# EAGLE board GNUBLIN_LAN_V2.3 (EAGLE 6.4), part 1 of 2
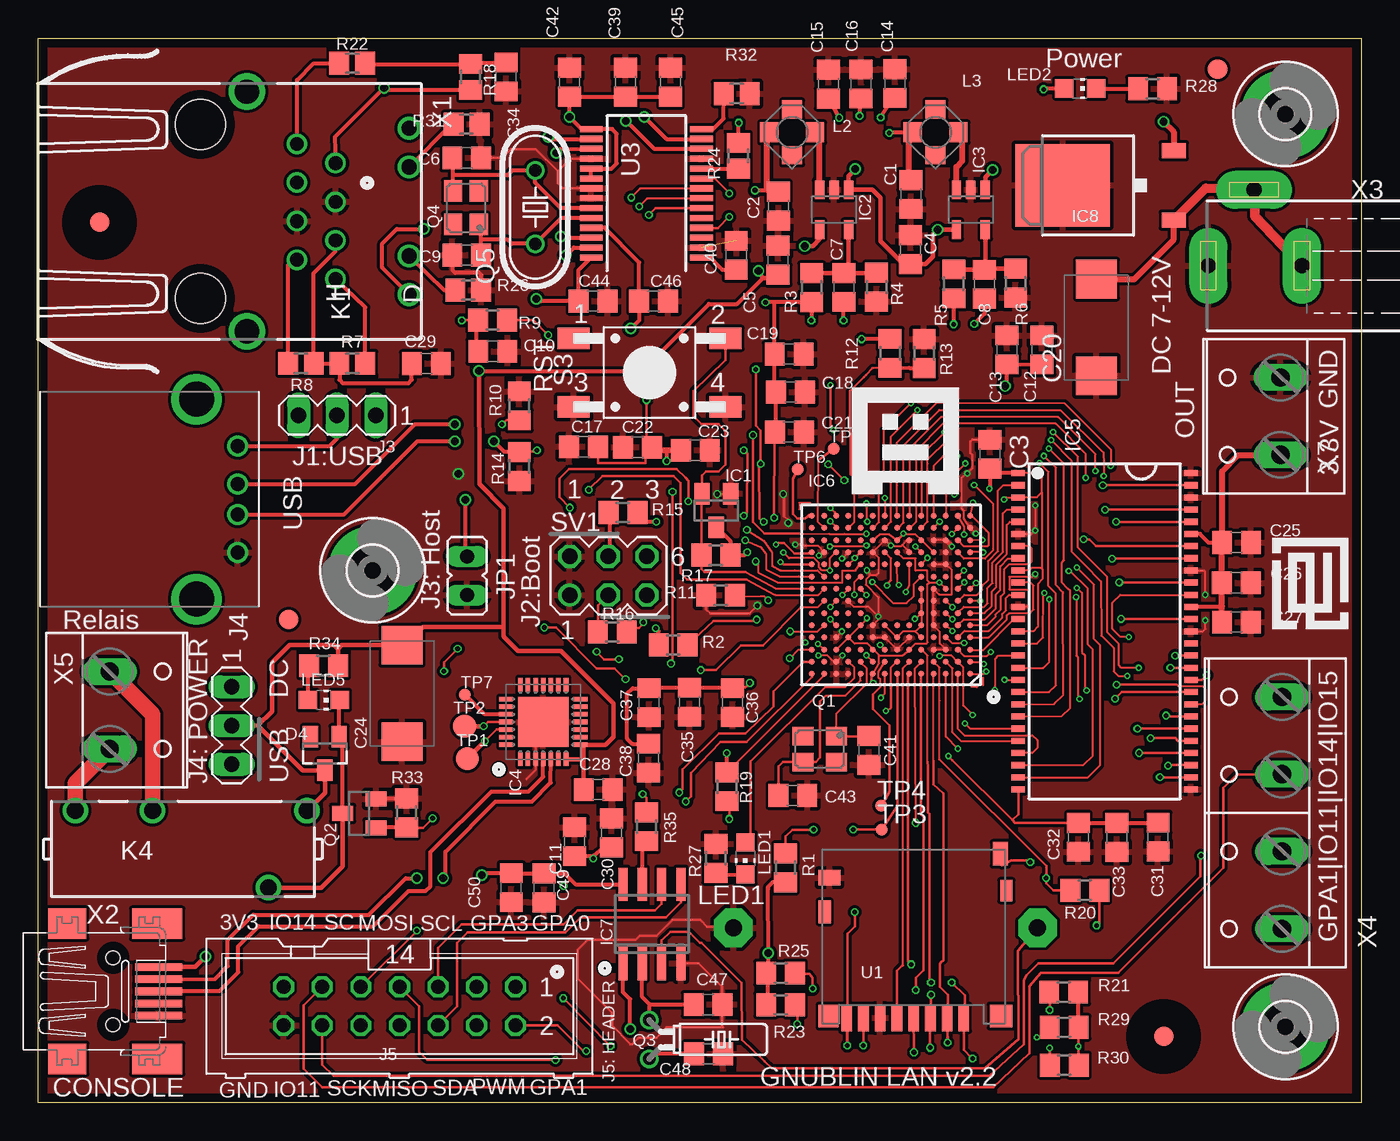
[diagram p4: board, top side]
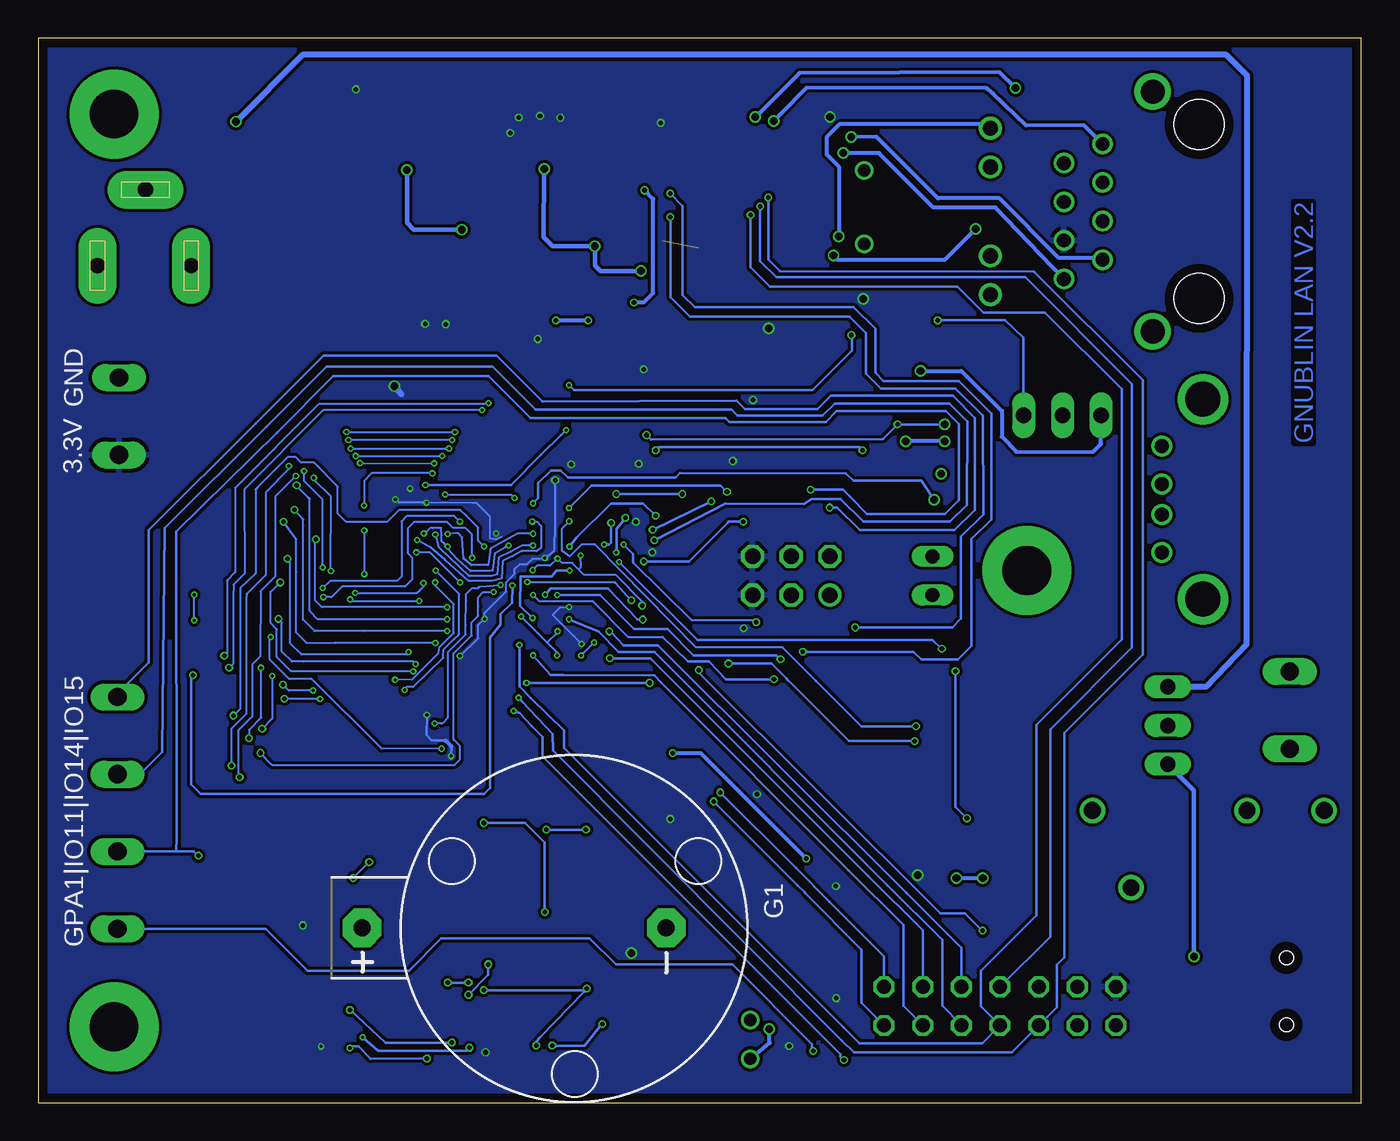
[diagram p5: board, bottom side, seen from below]

Size 87 x 70 mm. Coordinates in mm from the lower left corner, seen from the top.
Outline: 0,70 87,70 87,0 0,0 0,70
Copper layers (1*16): Top 0.035mm / dielectric 0.1mm / Bottom 0.035mm
Design rules "default *": minimum track width 0.12mm, minimum drill 0.2mm, track to track 0.12mm, track to pad 0.12mm, pad to pad 0.12mm, via to via 0.12mm, smd to smd 0mil, copper to edge 0.6mm, drill to drill 8mil, minimum pad ring 6mil, minimum via ring 4mil, stop-mask expansion 2mil, vias tented up to drill 40mil, thermal gap 10mil
Net classes: 0 default: width 0.2 mm, drill 0.3 mm, clearance 0.2 mm; 1 500mA: width 0.3 mm, drill 0.3 mm, clearance 0.15 mm

## Footprints (pad centres in the part's own frame; a part is rotated, then mirrored left to right if it is on the bottom)
C0805 = smd 1.3 x 1.5: 1 -0.95,0; 2 0.95,0
D/7343-31R = smd 2.55 x 2.7: + 3.175,0; - -3.175,0
DIODE_SOT23 = smd 1 x 1.4: 1 -0.95,-1.1; 2 0.95,-1.1; 3 0,1.1
PASSERMARKEN_FIDUCIAL = smd 1.27 x 1.27: 1 0,0
CH25 = drill 1.118 pad 2.54 octagon: + 0,-14; - 0,6
3,2-PAD = drill 3.2 pad 5.842: B3,2 0,0
SOT23 = smd 1 x 1.4: 1 -0.95,-1.1; 2 0.95,-1.1; 3 0,1.1
TSOT23 = smd 0.622 x 1.22: 1 -0.95,-1.31; 2 0,-1.31; 3 0.95,-1.31; 4 0.95,1.31; 5 -0.95,1.31
MLP28 = smd 0.9 x 0.3: 1 -2.45,1.5; 2 -2.45,1; 3 -2.45,0.5; 4 -2.45,0; 5 -2.45,-0.5; 6 -2.45,-1; 7 -2.45,-1.5; 15 2.45,-1.5; 16 2.45,-1; 17 2.45,-0.5; 18 2.45,0; 19 2.45,0.5; 20 2.45,1; 21 2.45,1.5 | smd 0.3 x 0.9: 8 -1.5,-2.45; 9 -1,-2.45; 10 -0.5,-2.45; 11 0,-2.45; 12 0.5,-2.45; 13 1,-2.45; 14 1.5,-2.45; 22 1.5,2.45; 23 1,2.45; 24 0.5,2.45; 25 0,2.45; 26 -0.5,2.45; 27 -1,2.45; 28 -1.5,2.45 | smd 3.3 x 3.3: EXP 0,0
TSOPII = smd 0.4 x 0.9: 1 1.03,0.67; 2 1.83,0.67; 3 2.63,0.67; 4 3.43,0.67; 5 4.23,0.67; 6 5.03,0.67; 7 5.83,0.67; 8 6.63,0.67; 9 7.43,0.67; 10 8.23,0.67; 11 9.03,0.67; 12 9.83,0.67; 13 10.63,0.67; 14 11.43,0.67; 15 12.23,0.67; 16 13.03,0.67; 17 13.83,0.67; 18 14.63,0.67; 19 15.43,0.67; 20 16.23,0.67; 21 17.03,0.67; 22 17.83,0.67; 23 18.63,0.67; 24 19.43,0.67; 25 20.23,0.67; 26 21.03,0.67; 27 21.83,0.67; 28 21.83,12.03; 29 21.03,12.03; 30 20.23,12.03; 31 19.43,12.03; 32 18.63,12.03; 33 17.83,12.03; 34 17.03,12.03; 35 16.23,12.03; 36 15.43,12.03; 37 14.63,12.03; 38 13.83,12.03; 39 13.03,12.03; 40 12.23,12.03; 41 11.43,12.03; 42 10.63,12.03; 43 9.83,12.03; 44 9.03,12.03; 45 8.23,12.03; 46 7.43,12.03; 47 6.63,12.03; 48 5.83,12.03; 49 5.03,12.03; 50 4.23,12.03; 51 3.43,12.03; 52 2.63,12.03; 53 1.83,12.03; 54 1.03,12.03
TFBGA180 = smd 0.4 x 0.4: A1 -5.2,5.2; A2 -4.4,5.2; A3 -3.6,5.2; A4 -2.8,5.2; A5 -2,5.2; A6 -1.2,5.2; A7 -0.4,5.2; A8 0.4,5.2; A9 1.2,5.2; A10 2,5.2; A11 2.8,5.2; A12 3.6,5.2; A13 4.4,5.2; A14 5.2,5.2; B1 -5.2,4.4; B2 -4.4,4.4; B3 -3.6,4.4; B4 -2.8,4.4; B5 -2,4.4; B6 -1.2,4.4; B7 -0.4,4.4; B8 0.4,4.4; B9 1.2,4.4; B10 2,4.4; B11 2.8,4.4; B12 3.6,4.4; B13 4.4,4.4; B14 5.2,4.4; C1 -5.2,3.6; C2 -4.4,3.6; C3 -3.6,3.6; C4 -2.8,3.6; C5 -2,3.6; C6 -1.2,3.6; C7 -0.4,3.6; C8 0.4,3.6; C9 1.2,3.6; C10 2,3.6; C11 2.8,3.6; C12 3.6,3.6; C13 4.4,3.6; C14 5.2,3.6; D1 -5.2,2.8; D2 -4.4,2.8; D3 -3.6,2.8; D4 -2.8,2.8; D5 -2,2.8; D6 -1.2,2.8; D7 -0.4,2.8; D8 0.4,2.8; D9 1.2,2.8; D10 2,2.8; D11 2.8,2.8; D12 3.6,2.8; D13 4.4,2.8; D14 5.2,2.8; E1 -5.2,2; E2 -4.4,2; E3 -3.6,2; E4 -2.8,2; E5 -2,2; E6 -1.2,2; E7 -0.4,2; E8 0.4,2; E9 1.2,2; E10 2,2; E11 2.8,2; E12 3.6,2; E13 4.4,2; E14 5.2,2; F1 -5.2,1.2; F2 -4.4,1.2; F3 -3.6,1.2; F4 -2.8,1.2; F5 -2,1.2; F10 2,1.2; F11 2.8,1.2; F12 3.6,1.2; F13 4.4,1.2; F14 5.2,1.2; G1 -5.2,0.4; G2 -4.4,0.4; G3 -3.6,0.4; G4 -2.8,0.4; G5 -2,0.4; G10 2,0.4; G11 2.8,0.4; G12 3.6,0.4; G13 4.4,0.4; G14 5.2,0.4; H1 -5.2,-0.4; H2 -4.4,-0.4; H3 -3.6,-0.4; H4 -2.8,-0.4; H5 -2,-0.4; H10 2,-0.4; H11 2.8,-0.4; H12 3.6,-0.4; H13 4.4,-0.4; H14 5.2,-0.4; J1 -5.2,-1.2; J2 -4.4,-1.2; J3 -3.6,-1.2; J4 -2.8,-1.2; J5 -2,-1.2; J10 2,-1.2; J11 2.8,-1.2; J12 3.6,-1.2; J13 4.4,-1.2; J14 5.2,-1.2; K1 -5.2,-2; K2 -4.4,-2; K3 -3.6,-2; K4 -2.8,-2; K5 -2,-2; K6 -1.2,-2; K7 -0.4,-2; K8 0.4,-2; K9 1.2,-2; K10 2,-2; K11 2.8,-2; K12 3.6,-2; K13 4.4,-2; K14 5.2,-2; L1 -5.2,-2.8; L2 -4.4,-2.8; L3 -3.6,-2.8; L4 -2.8,-2.8; L5 -2,-2.8; L6 -1.2,-2.8; L7 -0.4,-2.8; L8 0.4,-2.8; L9 1.2,-2.8; L10 2,-2.8; L11 2.8,-2.8; L12 3.6,-2.8; L13 4.4,-2.8; L14 5.2,-2.8; M1 -5.2,-3.6; M2 -4.4,-3.6; M3 -3.6,-3.6; M4 -2.8,-3.6; M5 -2,-3.6; M6 -1.2,-3.6; M7 -0.4,-3.6; M8 0.4,-3.6; M9 1.2,-3.6; M10 2,-3.6; M11 2.8,-3.6; M12 3.6,-3.6; M13 4.4,-3.6; M14 5.2,-3.6; N1 -5.2,-4.4; N2 -4.4,-4.4; N3 -3.6,-4.4; N4 -2.8,-4.4; N5 -2,-4.4; N6 -1.2,-4.4; N7 -0.4,-4.4; N8 0.4,-4.4; N9 1.2,-4.4; N10 2,-4.4; N11 2.8,-4.4; N12 3.6,-4.4; N13 4.4,-4.4; N14 5.2,-4.4; P1 -5.2,-5.2; P2 -4.4,-5.2; P3 -3.6,-5.2; P4 -2.8,-5.2; P5 -2,-5.2; P6 -1.2,-5.2; P7 -0.4,-5.2; P8 0.4,-5.2; P9 1.2,-5.2; P10 2,-5.2; P11 2.8,-5.2; P12 3.6,-5.2; P13 4.4,-5.2; P14 5.2,-5.2
SOIC-8 = smd 0.6 x 2.2: 1 -1.905,-2.6; 2 -0.635,-2.6; 3 0.635,-2.6; 4 1.905,-2.6; 5 1.905,2.6; 6 0.635,2.6; 7 -0.635,2.6; 8 -1.905,2.6
DPACK_3 = smd 1 x 1.6: 1 -2.28,-4.8; 3 2.28,-4.8 | smd 5.4 x 6.2: 4 0,2.5
MA03-1 = drill 1.016 long: 1 -2.54,0; 2 0,0; 3 2.54,0
ML14 = drill 0.914 octagon: 1 -7.62,-1.27; 2 -7.62,1.27; 3 -5.08,-1.27; 4 -5.08,1.27; 5 -2.54,-1.27; 6 -2.54,1.27; 7 0,-1.27; 8 0,1.27; 9 2.54,-1.27; 10 2.54,1.27; 11 5.08,-1.27; 12 5.08,1.27; 13 7.62,-1.27; 14 7.62,1.27
JP1 = drill 0.914 long: 1 0,-1.27; 2 0,1.27
61400416021 = drill 0.92: 1 -3.5,2.7; 2 -1,2.7; 3 1,2.7; 4 3.5,2.7 | drill 2.3: 5 -6.57,0; 6 6.57,0
RELAY_G6D = drill 1.1 pad 1.676: 1 8.08,2.5; 5 -2.08,2.5; 7 -7.16,2.5; 13 5.54,-2.58
PSU3014 = smd 1.2 x 1.3: 1 -1.5,0; 2 1.5,0 | smd 1.3 x 1.2: 3 0,1.5; 4 0,-1.5
CHIP-LED0805 = smd 1.2 x 1.2: A 0,-1.05; C 0,1.05
SX-32 = smd 1.4 x 1.2: 1 -1.1,-0.85; 2 1.1,-0.85; 3 1.1,0.85; 4 -1.1,0.85
TRANSISTOR-SMALL-SIGNAL_SOT23 = smd 1 x 1.4: 1 -0.95,-1.1; 2 0.95,-1.1; 3 0,1.1
TC26H = drill 0.813: 1 -1.27,0; 2 1.27,0
HC49/S = drill 0.813: 1 -2.413,0; 2 2.413,0
R0805 = smd 1.3 x 1.5: 1 -0.95,0; 2 0.95,0
R0805' = smd 1.3 x 1.5: 1 -0.85,0; 2 0.85,0
TASTER-9314_SMD = smd 2.1 x 1.4: 1 -5,2.25; 2 5,2.25; 3 -5,-2.25; 4 5,-2.25
MA03-2 = drill 1.016: 1 -2.54,-1.27 | drill 1.016 octagon: 2 -2.54,1.27; 3 0,-1.27; 4 0,1.27; 5 2.54,-1.27; 6 2.54,1.27
TP15R = smd 1.5 x 1.5: TP 0,0
TP08R = smd 0.8 x 0.8: TP 0,0
DM3D-SF = smd 0.7 x 1.75: 1 7.7,-0.875; 2 6.6,-0.875; 3 5.5,-0.875; 4 4.4,-0.875; 5 3.3,-0.875; 6 2.2,-0.875; 7 1.1,-0.875; 8 0,-0.875 | smd 1.3 x 1.5: P$1 -1.2,-0.75 | smd 1.5 x 1.5: P$10 10.15,-0.75 | smd 0.8 x 1.4: P$11 10.5,7.5 | smd 0.8 x 1.5: P$13 -1.45,6.1 | smd 1 x 1.55: SW_A 10.1,9.925 | smd 1.45 x 1: SW_B -1.125,8.35
SSOP28 = smd 0.4 x 1.5: 1 -4.225,-3.625; 2 -3.575,-3.625; 3 -2.925,-3.625; 4 -2.275,-3.625; 5 -1.625,-3.625; 6 -0.975,-3.625; 7 -0.325,-3.625; 8 0.325,-3.625; 9 0.975,-3.625; 10 1.625,-3.625; 11 2.275,-3.625; 12 2.925,-3.625; 13 3.575,-3.625; 14 4.225,-3.625; 15 4.225,3.625; 16 3.575,3.625; 17 2.925,3.625; 18 2.275,3.625; 19 1.625,3.625; 20 0.975,3.625; 21 0.325,3.625; 22 -0.325,3.625; 23 -0.975,3.625; 24 -1.625,3.625; 25 -2.275,3.625; 26 -2.925,3.625; 27 -3.575,3.625; 28 -4.225,3.625
J1 = drill 0.9 pad 1.3: 1 4.445,2.54; 2 3.175,0; 3 1.905,2.54; 4 0.635,0; 5 -0.635,2.54; 6 -1.905,0; 7 -3.175,2.54; 8 -4.445,0 | drill 1 pad 1.422: 9 5.465,7.37; 10 2.925,7.37; 11 -2.925,7.37; 12 -5.465,7.37 | drill 1.6 pad 2.184: M1 -7.875,-3.3; M2 7.875,-3.3 | hole 3.3: 5.715,-6.35; -5.715,-6.35
32005-201 = smd 3.1 x 0.5: 1 3,1.6; 2 3,0.8; 3 3,0; 4 3,-0.8; 5 3,-1.6 | smd 2.5 x 2: M1 -3,-4.45; M2 -3,4.45 | smd 3.3 x 2: M3 2.9,4.45; M4 2.9,-4.45 | hole 0.9: 0,2.2; 0,-2.2
733980-62 = drill 1 pad 2.5 long: 1 0,8.57; 2 0,2.42; 3 5,5.57
W237-4P = drill 1.194 long: 1 -7.62,-0.635; 2 -2.54,-0.635; 3 2.54,-0.635; 4 7.62,-0.635
W237-132 = drill 1.194 long: 1 -2.54,-0.635; 2 2.54,-0.635

## Placement (x,y rotation side)
C1  10uF  [C0805]  57.37,59.71 90 top
C2  10uF  [C0805]  48.67,58.94 90 top
C3  100nF  [C0805]  62.58,42.64 270 top
C4  4.7uF  [C0805]  57.35,56.09 90 top
C5  4.7uF  [C0805]  48.65,55.39 90 top
C6  22pF  [C0805]  28.18,62.12 180 top
C7  22pF  [C0805]  52.98,53.6 90 top
C8  22pF  [C0805]  62.22,53.81 90 top
C9  22pF  [C0805]  28.18,55.73 0 top
C10  100nF  [C0805]  29.9,49.4 180 top
C11  100nF  [C0805]  35.27,17.17 270 top
C12  3.3nF  [C0805]  66,49.5 270 top
C13  10uF  [C0805]  63.7,49.5 270 top
C14  10uF  [C0805]  56.33,67.01 270 top
C15  3.3nF  [C0805]  51.95,66.97 270 top
C16  100nF  [C0805]  54.1,66.98 270 top
C17  3.3nF  [C0805]  35.86,43.13 0 top
C18  100nF  [C0805]  49.47,46.72 180 top
C19  3.3nF  [C0805]  49.38,49.23 180 top
C20  10uF  [D/7343-31R]  69.58,50.97 90 top
C21  10uF  [C0805]  49.39,44.1 180 top
C22  100nF  [C0805]  39.41,43.09 0 top
C23  10uF  [C0805]  43.21,42.9 180 top
C24  10uF  [D/7343-31R]  23.93,26.91 90 top
C25  3.3nF  [C0805]  78.79,36.83 180 top
C26  100nF  [C0805]  78.78,34.19 180 top
C27  10uF  [C0805]  78.78,31.6 180 top
C28  4.7uF  [C0805]  36.82,20.59 0 top
C29  100nF  [C0805]  25.53,48.6 0 top
C30  10uF  [C0805]  37.7,17.74 270 top
C31  3.3nF  [C0805]  73.63,17.47 90 top
C32  10uF  [C0805]  68.39,17.46 90 top
C33  100nF  [C0805]  70.92,17.44 90 top
C34  100nF  [C0805]  30.76,67.44 90 top
C35  100nF  [C0805]  42.82,26.33 90 top
C36  3.3nF  [C0805]  45.66,26.31 90 top
C37  10uF  [C0805]  40.17,26.3 90 top
C38  100nF  [C0805]  40.13,22.65 90 top
C39  100nF  [C0805]  38.61,67.1 90 top
C40  10uF  [C0805]  45.9,55.72 90 top
C41  22pF  [C0805]  54.62,23.17 90 top
C42  100nF  [C0805]  34.94,67.09 90 top
C43  22pF  [C0805]  49.62,20.2 180 top
C44  100nF  [C0805]  36.48,52.71 0 top
C45  100nF  [C0805]  41.58,67.1 90 top
C46  100nF  [C0805]  40.46,52.7 0 top
C47  22pF  [C0805]  44.05,6.46 0 top
C48  22pF  [C0805]  44.08,3.22 0 top
C49  100nF  [C0805]  33.27,14.13 270 top
C50  2.2uF  [C0805]  31.11,14.15 270 top
D4  BAT54  [DIODE_SOT23]  18.85,22.96 180 top
FID1  [PASSERMARKEN_FIDUCIAL]  4.05,57.89 0 top
FID2  [PASSERMARKEN_FIDUCIAL]  74,4.36 0 top
FID3  [PASSERMARKEN_FIDUCIAL]  16.46,31.76 0 top
FID4  [PASSERMARKEN_FIDUCIAL]  77.54,67.95 0 top
G1  CH25-2032LF  [CH25]  51.71,11.5 270 bottom
H1  MOUNT-PAD-ROUND3.2  [3,2-PAD]  82,5 0 top
H2  MOUNT-PAD-ROUND3.2  [3,2-PAD]  22,35 0 top
H4  MOUNT-PAD-ROUND3.2  [3,2-PAD]  82,65 0 top
IC1  APX803  [SOT23]  44.59,38.94 180 top
IC2  AS1324  [TSOT23]  52.33,58.71 180 top
IC3  AS1324  [TSOT23]  61.32,58.71 180 top
IC4  CP21021  [MLP28]  33.21,25.04 90 top
IC5  A43E26161TSOPII  [TSOPII]  63.76,42.43 270 top
IC6  LPC313XFET180  [TFBGA180]  56.07,33.4 180 top
IC7  MCP7940SOIC  [SOIC-8]  40.36,11.76 0 top
IC8  MC78M05ABDT  [DPACK_3]  69.86,60.31 90 top
J3  [MA03-1]  19.66,45.19 180 top
J4  [MA03-1]  12.73,24.8 270 top
J5  [ML14]  23.76,6.35 180 top
JP1  [JP1]  28.2,34.65 0 top
K1  61400416021  [61400416021]  10.42,39.68 270 top
K4  G6D-1A-ASI5VDC  [RELAY_G6D]  9.61,16.72 0 top
L2  4u7  [PSU3014]  49.57,63.8 180 top
L3  4u7  [PSU3014]  59,63.8 180 top
LED1  ROT  [CHIP-LED0805]  46.5,16.07 180 top
LED2  GRUEN  [CHIP-LED0805]  68.51,66.68 270 top
LED5  GRUEN  [CHIP-LED0805]  18.79,26.48 270 top
Q1  SX-32 - 12 MHz  [SX-32]  51.39,23.25 180 top
Q2  BSS123  [TRANSISTOR-SMALL-SIGNAL_SOT23]  21.12,19.02 90 top
Q3  32.768kHz  [TC26H]  40.17,4.16 270 top
Q4  SX-32 - 25 MHZ  [SX-32]  28.13,58.84 90 top
Q5  HC49S - 25MHz  [HC49/S]  32.69,58.88 90 top
R1  10K  [R0805]  49.14,15.45 270 top
R2  10K  [R0805]  41.75,30.1 0 top
R3  301K  [R0805]  50.86,53.59 270 top
R4  301K  [R0805]  55.12,53.62 90 top
R5  301K  [R0805]  60.2,53.84 270 top
R6  66K5  [R0805]  64.26,53.88 90 top
R7  49R9  [R0805']  20.66,48.61 0 top
R8  49R9  [R0805']  17.29,48.61 180 top
R9  10K  [R0805]  29.88,51.45 0 top
R10  1M  [R0805]  31.64,45.82 270 top
R11  12K 1%  [R0805]  44.87,33.37 0 top
R12  10K  [R0805]  56.01,49.27 90 top
R13  DNP  [R0805]  58.25,49.26 270 top
R14  1M  [R0805]  31.64,41.83 90 top
R15  10K  [R0805]  38.45,38.8 180 top
R16  10K  [R0805]  37.75,30.95 0 top
R17  10K  [R0805]  44.56,36 0 top
R18  49R9  [R0805']  28.44,67.44 90 top
R19  22R  [R0805]  45.29,20.77 90 top
R20  10K  [R0805]  68.81,13.97 180 top
R21  10K  [R0805]  67.42,7.28 180 top
R22  49R9  [R0805']  20.65,68.34 0 top
R23  10K  [R0805]  48.81,6.44 0 top
R24  10K  [R0805']  46.04,62.26 90 top
R25  10K  [R0805]  48.81,8.53 0 top
R26  270R  [R0805']  28.28,53.43 180 top
R27  270R  [R0805]  44.56,16.07 270 top
R28  270R  [R0805]  73.27,66.66 180 top
R29  10K  [R0805]  67.46,4.96 180 top
R30  10K  [R0805]  67.46,2.47 180 top
R31  270R  [R0805']  28.17,64.33 180 top
R32  2.2K/1%  [R0805']  45.93,66.35 180 top
R33  10K  [R0805]  24.23,19.06 270 top
R34  270R  [R0805]  18.77,28.74 0 top
R35  10K  [R0805]  40,18.15 90 top
S3  [TASTER-9314_SMD]  40.2,48 0 top
SV1  [MA03-2]  37.49,34.65 0 top
TP1  TPTP15R  [TP15R]  28.23,22.62 0 top
TP2  TPTP15R  [TP15R]  28.04,24.75 0 top
TP3  PTR1TP08R  [TP08R]  55.47,17.96 0 top
TP4  PTR1TP08R  [TP08R]  55.44,19.52 0 top
TP5  TPTP08R  [TP08R]  52.3,42.99 0 top
TP6  TPTP08R  [TP08R]  49.95,41.65 0 top
TP7  TPTP08R  [TP08R]  28.07,26.83 0 top
U1  DM3D-SF  [DM3D-SF]  53.16,6.45 0 top
U3  ENC28J60-SSOP  [SSOP28]  39.99,59.79 90 top
U$3  EPLOGOSIEB  [EPLOGOSIEBDRUCK]  86.14,31.14 90 top
U$7  GNUBLINLOGOSIEB  [GNUSIEBDRUCK]  53.52,40.02 0 top
X1  J1011F21P  [J1]  17.02,58.6 270 top
X2  MINI-USB-32005-201  [32005-201]  4.93,7.33 0 top
X3  [733980-62]  85.51,55.03 90 top
X4  [W237-4P]  81.14,19.06 90 top
X5  [W237-132]  5.35,25.81 270 top
X7  [W237-132]  81.04,45.14 90 top